# EAGLE design Configuration_Board_B (EAGLE 6.3)
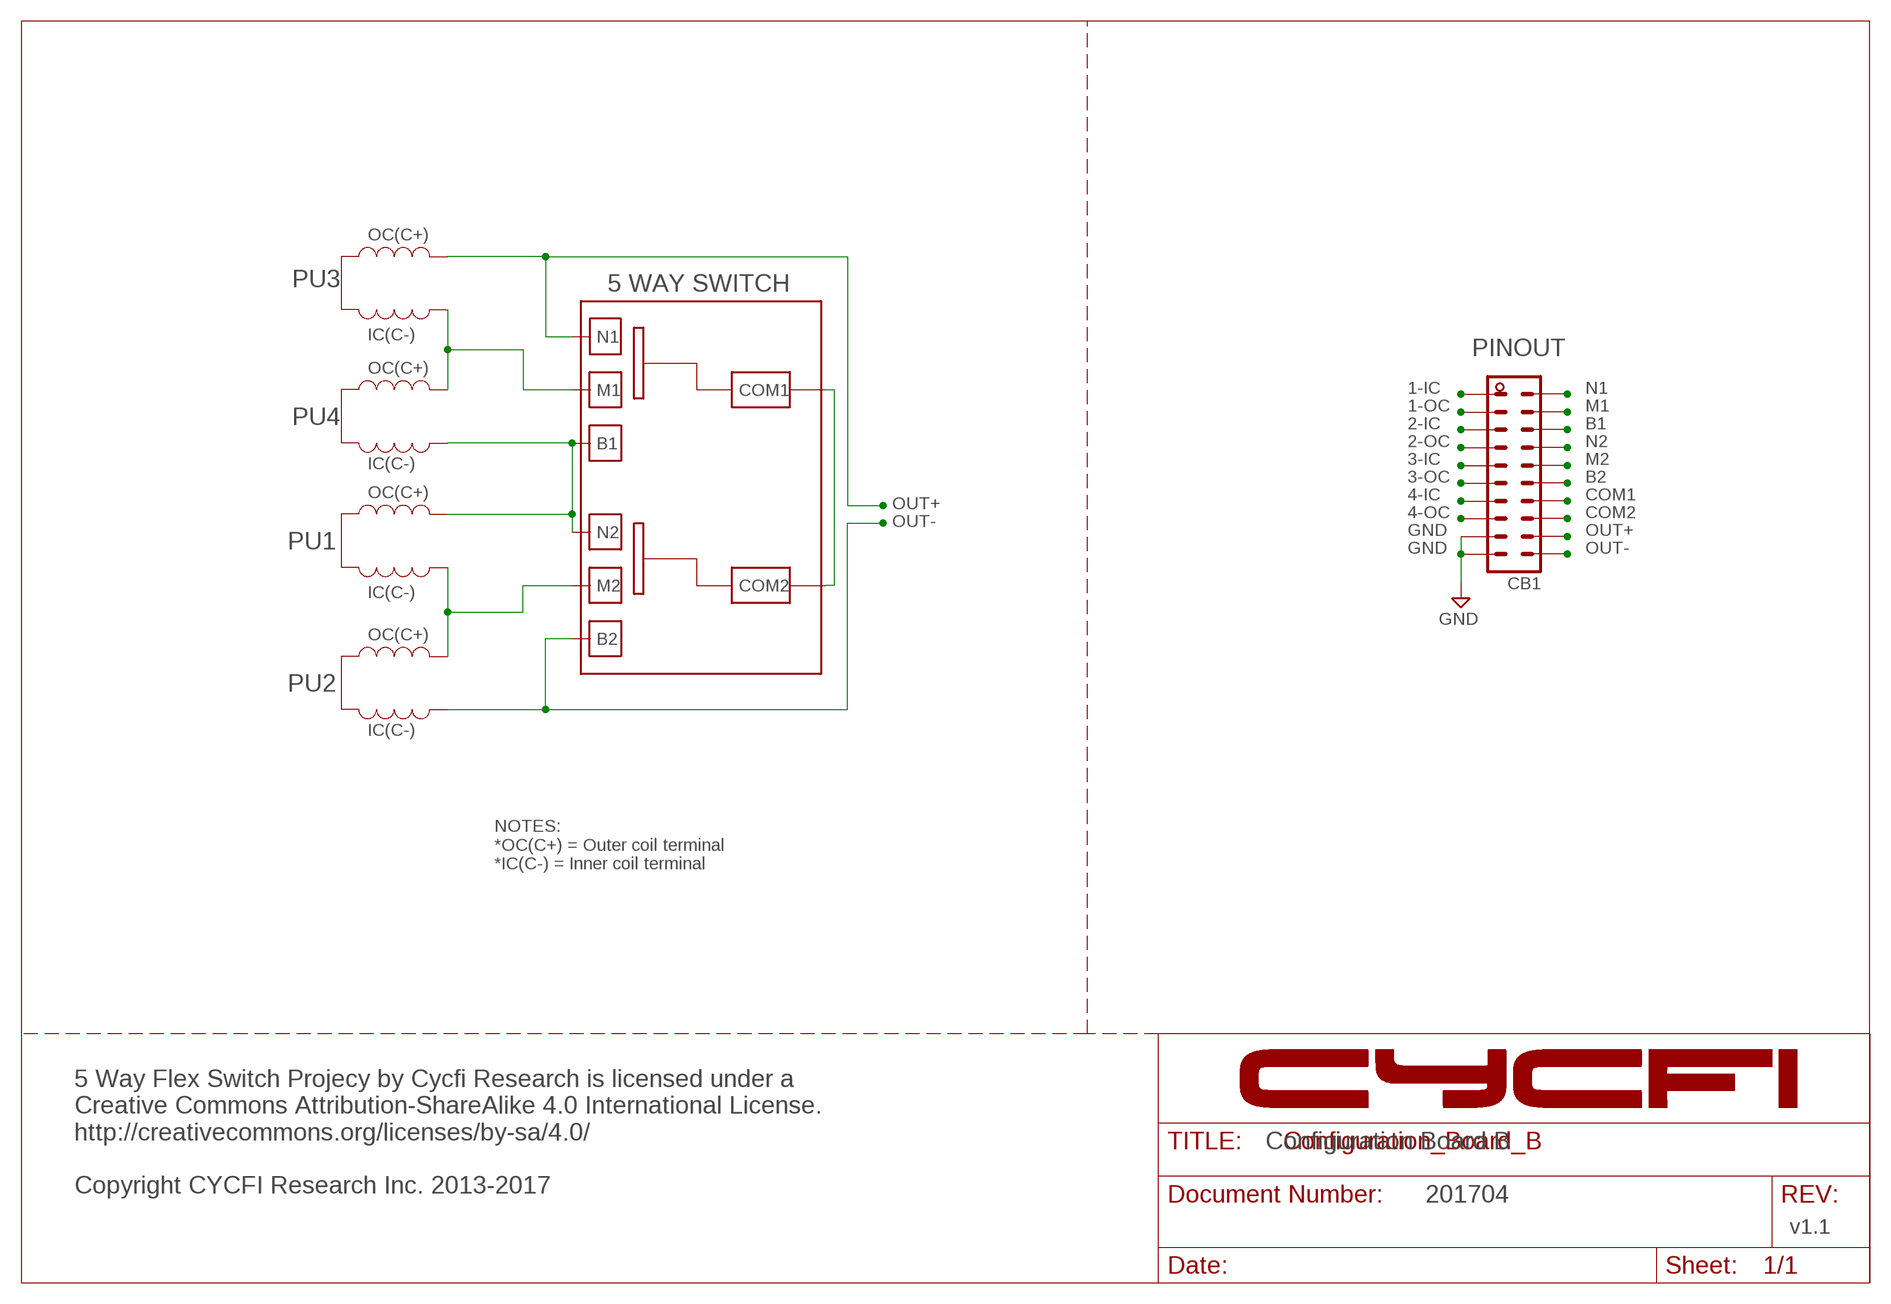
[diagram p0: schematic, sheet 1]

## Parts
CB1  CONFIGURATION_BRD_CAST  [CONFIGURATION_BRD_CAST]

## Nets
1: CB1.3-OC CB1.N1 CB1.OUT+
2: CB1.3-IC CB1.4-OC CB1.M1
3: CB1.1-OC CB1.4-IC CB1.B1 CB1.N2
4: CB1.COM1 CB1.COM2
5: CB1.1-IC CB1.2-OC CB1.M2
6: CB1.2-IC CB1.B2 CB1.OUT-
GND: CB1.GND CB1.GND1

## Notes on the sheet
- OC(C+)
- PU3 | 5 WAY SWITCH
- IC(C-) | N1
- PINOUT
- OC(C+)
- M1 | COM1 | 1-IC | N1
- 1-OC | M1
- PU4 | 2-IC | B1
- B1 | 2-OC | N2
- IC(C-) | 3-IC | M2
- 3-OC | B2
- OC(C+) | 4-IC | COM1
- OUT+
- 4-OC | COM2
- OUT-
- N2 | GND | OUT+
- PU1 | GND | OUT-
- M2 | COM2
- IC(C-)
- OC(C+) | B2
- PU2
- IC(C-)
- NOTES:
  *OC(C+) = Outer coil terminal
  *IC(C-) = Inner coil terminal
- Configuration Board B
- 5 Way Flex Switch Projecy by Cycfi Research is licensed under a 
  Creative Commons Attribution-ShareAlike 4.0 International License.
  http://creativecommons.org/licenses/by-sa/4.0/
  
  Copyright CYCFI Research Inc. 2013-2017
- 201704
- v1.1

## Library data of the parts
CB1 = CYCFI_Module_castellated:CONFIGURATION_BRD_CAST

## Board
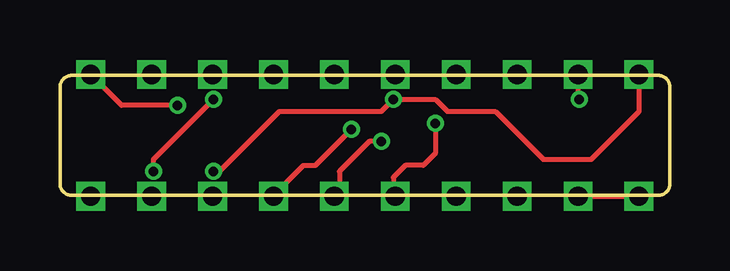
[diagram p1: board, top side]
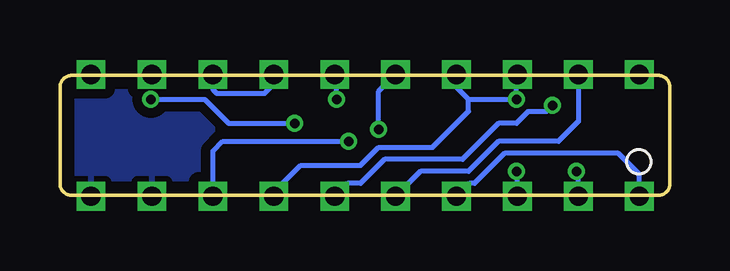
[diagram p2: board, bottom side, seen from below]

Size 25.44 x 5 mm. Coordinates in mm from the lower left corner, seen from the top.
Outline: 25.44,4.5 25.44,0.5 arc-90 24.94,0 0.5,0 arc-90 0,0.5 0,4.5 arc-90 0.5,5 24.94,5 arc-90 25.44,4.5
Copper layers (1*16): Top 0.035mm / dielectric 1.6mm / Bottom 0.035mm
Design rules "Elecrow_2-layer_PCB_eagle_rule": minimum track width 6mil, minimum drill 12mil, track to track 6mil, track to pad 8mil, pad to pad 12mil, via to via 12mil, smd to smd 0mil, copper to edge 20mil, drill to drill 10mil, minimum pad ring 6mil, minimum via ring 6mil, stop-mask expansion 0mil, vias tented up to drill 100mil, thermal gap 10mil

### Footprints (pad centres in the part's own frame; a part is rotated, then mirrored left to right if it is on the bottom)
CONFIGURATION_BRD_CAST = drill 0.8 square: 1-IC -8.89,-2.54; 1-OC -6.35,-2.54; 2-IC -3.81,-2.54; 2-OC -1.27,-2.54; 3-IC 1.27,-2.54; 3-OC 3.81,-2.54; 4-IC 6.35,-2.54; 4-OC 8.89,-2.54; B1 -3.81,2.54; B2 3.81,2.54; COM1 6.35,2.54; COM2 8.89,2.54; GND 11.43,-2.54; GND1 13.97,-2.54; M1 -6.35,2.54; M2 1.27,2.54; N1 -8.89,2.54; N2 -1.27,2.54; OUT+ 11.43,2.54; OUT- 13.97,2.54

### Placement (x,y rotation side)
CB1  10.17,2.5 0 top

### Tracks (layer width: path | path; a pad name or v marks a point on that pad's centre or on a via)
1  (via drill 0.4)
  Top 0.203: CB1.OUT+ 21.6,4.05 v21.65,4 | v15.65,3 15.65,1.75 15.15,1.25 14.4,1.25 13.9,0.75 13.9,0.04 CB1.3-OC | v4.9,3.75 2.57,3.75 CB1.N1
  Bottom 0.203: v21.65,4 19.4,4 18.4,3 v15.65,3 | CB1.3-OC 13.44,0.5 12.9,0.5 11.9,1.5 8.65,1.5 7.15,3 6.4,3 5.9,3.5 5.15,3.5 v4.9,3.75
2  (via drill 0.4)
  Top 0.203: v13.4,2.25 12.9,2.25 11.65,1 11.65,0.17 CB1.3-IC
  Bottom 0.203: CB1.M1 3.82,3.08 4.65,2.25 7.15,2.25 8.4,1 10.4,1 CB1.3-IC | CB1.4-OC 19.06,1.84 18.65,2.25 v13.4,2.25
3  (via drill 0.4)
  Top 0.203: v3.9,1 3.9,1.5 v6.4,4
  Bottom 0.203: CB1.1-OC 3.82,0.92 v3.9,1 | CB1.B1 6.4,5 v6.4,4 8.4,4 | CB1.N2 8.9,4.5 8.4,4 | CB1.4-IC 16.52,0.13 15.4,1.25 12.9,1.25 12.15,2 9.9,2 8.4,3.5 8.4,4
4
  Bottom 0.203: CB1.COM2 19.06,4.41 18.9,4.25 16.9,4.25 16.65,4.5 16.65,4.91 CB1.COM1
5  (via drill 0.4)
  Top 0.203: CB1.2-OC 8.9,0 10.15,1.25 10.65,1.25 v12.15,2.75
  Bottom 0.203: CB1.1-IC 1.28,0.88 2.15,1.75 6.9,1.75 8.15,0.5 8.36,0.5 CB1.2-OC | v12.15,2.75 12.15,4.33 CB1.M2
6  (via drill 0.4)
  Top 0.203: v6.4,1 6.65,1 9.15,3.5 13.4,3.5 v13.9,4 15.65,4 16.15,3.5 18.15,3.5 20.15,1.5 22.15,1.5 24.15,3.5 CB1.OUT-
  Bottom 0.203: v13.9,4 13.9,4.96 CB1.B2 | CB1.2-IC 6.36,0.96 v6.4,1
GND
  Top 0.203: CB1.GND CB1.GND1
  pour Top (isolate 0.305): 0,5 0,0 25.8,0 25.8,5
  pour Bottom (isolate 0.406): 0,5 0,0 25.8,0 25.8,5